# EAGLE design BUZZI-41 (EAGLE 4.15)
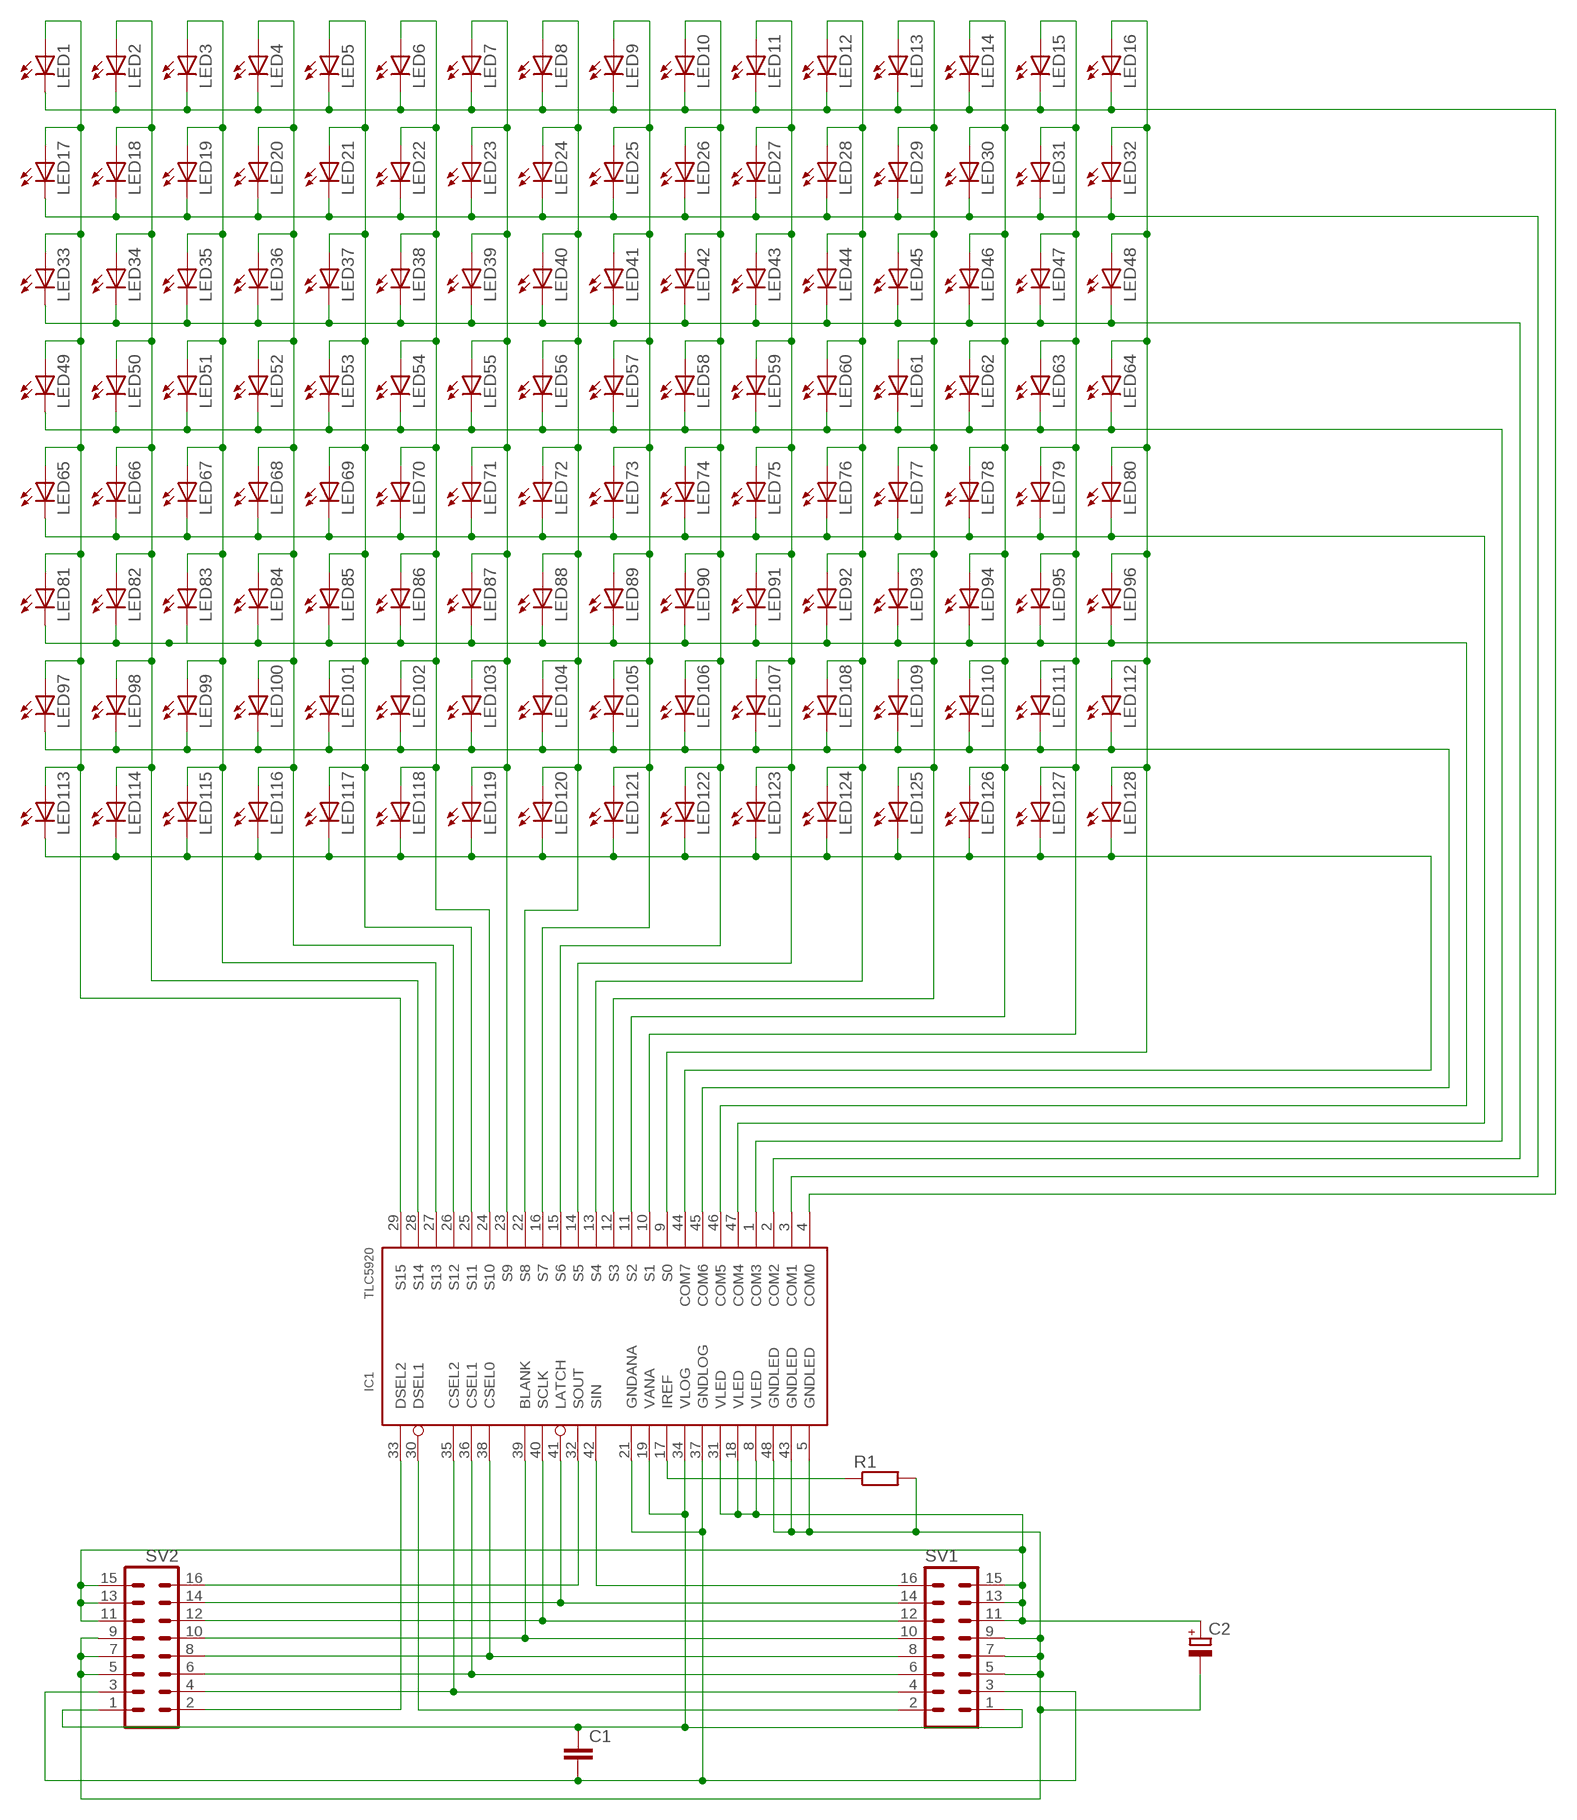
[diagram p0: schematic, sheet 1]

## Parts
C1  C-EUC0805K  [C0805K]
C2  CPOL-EUE3.5-8  [E3,5-8]
IC1  TLC5920  [SSOP48DL]
LED1  LED5MM  [LED5MM]
LED2  LED5MM  [LED5MM]
LED3  LED5MM  [LED5MM]
LED4  LED5MM  [LED5MM]
LED5  LED5MM  [LED5MM]
LED6  LED5MM  [LED5MM]
LED7  LED5MM  [LED5MM]
LED8  LED5MM  [LED5MM]
LED9  LED5MM  [LED5MM]
LED10  LED5MM  [LED5MM]
LED11  LED5MM  [LED5MM]
LED12  LED5MM  [LED5MM]
LED13  LED5MM  [LED5MM]
LED14  LED5MM  [LED5MM]
LED15  LED5MM  [LED5MM]
LED16  LED5MM  [LED5MM]
LED17  LED5MM  [LED5MM]
LED18  LED5MM  [LED5MM]
LED19  LED5MM  [LED5MM]
LED20  LED5MM  [LED5MM]
LED21  LED5MM  [LED5MM]
LED22  LED5MM  [LED5MM]
LED23  LED5MM  [LED5MM]
LED24  LED5MM  [LED5MM]
LED25  LED5MM  [LED5MM]
LED26  LED5MM  [LED5MM]
LED27  LED5MM  [LED5MM]
LED28  LED5MM  [LED5MM]
LED29  LED5MM  [LED5MM]
LED30  LED5MM  [LED5MM]
LED31  LED5MM  [LED5MM]
LED32  LED5MM  [LED5MM]
LED33  LED5MM  [LED5MM]
LED34  LED5MM  [LED5MM]
LED35  LED5MM  [LED5MM]
LED36  LED5MM  [LED5MM]
LED37  LED5MM  [LED5MM]
LED38  LED5MM  [LED5MM]
LED39  LED5MM  [LED5MM]
LED40  LED5MM  [LED5MM]
LED41  LED5MM  [LED5MM]
LED42  LED5MM  [LED5MM]
LED43  LED5MM  [LED5MM]
LED44  LED5MM  [LED5MM]
LED45  LED5MM  [LED5MM]
LED46  LED5MM  [LED5MM]
LED47  LED5MM  [LED5MM]
LED48  LED5MM  [LED5MM]
LED49  LED5MM  [LED5MM]
LED50  LED5MM  [LED5MM]
LED51  LED5MM  [LED5MM]
LED52  LED5MM  [LED5MM]
LED53  LED5MM  [LED5MM]
LED54  LED5MM  [LED5MM]
LED55  LED5MM  [LED5MM]
LED56  LED5MM  [LED5MM]
LED57  LED5MM  [LED5MM]
LED58  LED5MM  [LED5MM]
LED59  LED5MM  [LED5MM]
LED60  LED5MM  [LED5MM]
LED61  LED5MM  [LED5MM]
LED62  LED5MM  [LED5MM]
LED63  LED5MM  [LED5MM]
LED64  LED5MM  [LED5MM]
LED65  LED5MM  [LED5MM]
LED66  LED5MM  [LED5MM]
LED67  LED5MM  [LED5MM]
LED68  LED5MM  [LED5MM]
LED69  LED5MM  [LED5MM]
LED70  LED5MM  [LED5MM]
LED71  LED5MM  [LED5MM]
LED72  LED5MM  [LED5MM]
LED73  LED5MM  [LED5MM]
LED74  LED5MM  [LED5MM]
LED75  LED5MM  [LED5MM]
LED76  LED5MM  [LED5MM]
LED77  LED5MM  [LED5MM]
LED78  LED5MM  [LED5MM]
LED79  LED5MM  [LED5MM]
LED80  LED5MM  [LED5MM]
LED81  LED5MM  [LED5MM]
LED82  LED5MM  [LED5MM]
LED83  LED5MM  [LED5MM]
LED84  LED5MM  [LED5MM]
LED85  LED5MM  [LED5MM]
LED86  LED5MM  [LED5MM]
LED87  LED5MM  [LED5MM]
LED88  LED5MM  [LED5MM]
LED89  LED5MM  [LED5MM]
LED90  LED5MM  [LED5MM]
LED91  LED5MM  [LED5MM]
LED92  LED5MM  [LED5MM]
LED93  LED5MM  [LED5MM]
LED94  LED5MM  [LED5MM]
LED95  LED5MM  [LED5MM]
LED96  LED5MM  [LED5MM]
LED97  LED5MM  [LED5MM]
LED98  LED5MM  [LED5MM]
LED99  LED5MM  [LED5MM]
LED100  LED5MM  [LED5MM]
LED101  LED5MM  [LED5MM]
LED102  LED5MM  [LED5MM]
LED103  LED5MM  [LED5MM]
LED104  LED5MM  [LED5MM]
LED105  LED5MM  [LED5MM]
LED106  LED5MM  [LED5MM]
LED107  LED5MM  [LED5MM]
LED108  LED5MM  [LED5MM]
LED109  LED5MM  [LED5MM]
LED110  LED5MM  [LED5MM]
LED111  LED5MM  [LED5MM]
LED112  LED5MM  [LED5MM]
LED113  LED5MM  [LED5MM]
LED114  LED5MM  [LED5MM]
LED115  LED5MM  [LED5MM]
LED116  LED5MM  [LED5MM]
LED117  LED5MM  [LED5MM]
LED118  LED5MM  [LED5MM]
LED119  LED5MM  [LED5MM]
LED120  LED5MM  [LED5MM]
LED121  LED5MM  [LED5MM]
LED122  LED5MM  [LED5MM]
LED123  LED5MM  [LED5MM]
LED124  LED5MM  [LED5MM]
LED125  LED5MM  [LED5MM]
LED126  LED5MM  [LED5MM]
LED127  LED5MM  [LED5MM]
LED128  LED5MM  [LED5MM]
R1  R-EU_R0805  [R0805]
SV1  MA08-2  [MA08-2]
SV2  MA08-2  [MA08-2]

## Nets
N$1: IC1.4(COM0) LED1.K(C) LED2.K(C) LED3.K(C) LED4.K(C) LED5.K(C) LED6.K(C) LED7.K(C) LED8.K(C) LED9.K(C) LED10.K(C) LED11.K(C) LED12.K(C) LED13.K(C) LED14.K(C) LED15.K(C) LED16.K(C)
N$2: IC1.29(S15) LED1.A LED17.A LED33.A LED49.A LED65.A LED81.A LED97.A LED113.A
N$3: IC1.28(S14) LED2.A LED18.A LED34.A LED50.A LED66.A LED82.A LED98.A LED114.A
N$4: IC1.27(S13) LED3.A LED19.A LED35.A LED51.A LED67.A LED83.A LED99.A LED115.A
N$5: IC1.26(S12) LED4.A LED20.A LED36.A LED52.A LED68.A LED84.A LED100.A LED116.A
N$6: IC1.25(S11) LED5.A LED21.A LED37.A LED53.A LED69.A LED85.A LED101.A LED117.A
N$7: IC1.24(S10) LED6.A LED22.A LED38.A LED54.A LED70.A LED86.A LED102.A LED118.A
N$8: IC1.23(S9) LED7.A LED23.A LED39.A LED55.A LED71.A LED87.A LED103.A LED119.A
N$9: IC1.22(S8) LED8.A LED24.A LED40.A LED56.A LED72.A LED88.A LED104.A LED120.A
N$10: IC1.16(S7) LED9.A LED25.A LED41.A LED57.A LED73.A LED89.A LED105.A LED121.A
N$11: IC1.15(S6) LED10.A LED26.A LED42.A LED58.A LED74.A LED90.A LED106.A LED122.A
N$12: IC1.14(S5) LED11.A LED27.A LED43.A LED59.A LED75.A LED91.A LED107.A LED123.A
N$13: IC1.13(S4) LED12.A LED28.A LED44.A LED60.A LED76.A LED92.A LED108.A LED124.A
N$14: IC1.12(S3) LED13.A LED29.A LED45.A LED61.A LED77.A LED93.A LED109.A LED125.A
N$15: IC1.11(S2) LED14.A LED30.A LED46.A LED62.A LED78.A LED94.A LED110.A LED126.A
N$16: IC1.10(S1) LED15.A LED31.A LED47.A LED63.A LED79.A LED95.A LED111.A LED127.A
N$17: IC1.9(S0) LED16.A LED32.A LED48.A LED64.A LED80.A LED96.A LED112.A LED128.A
N$18: IC1.3(COM1) LED17.K(C) LED18.K(C) LED19.K(C) LED20.K(C) LED21.K(C) LED22.K(C) LED23.K(C) LED24.K(C) LED25.K(C) LED26.K(C) LED27.K(C) LED28.K(C) LED29.K(C) LED30.K(C) LED31.K(C) LED32.K(C)
N$19: IC1.2(COM2) LED33.K(C) LED34.K(C) LED35.K(C) LED36.K(C) LED37.K(C) LED38.K(C) LED39.K(C) LED40.K(C) LED41.K(C) LED42.K(C) LED43.K(C) LED44.K(C) LED45.K(C) LED46.K(C) LED47.K(C) LED48.K(C)
N$20: IC1.1(COM3) LED49.K(C) LED50.K(C) LED51.K(C) LED52.K(C) LED53.K(C) LED54.K(C) LED55.K(C) LED56.K(C) LED57.K(C) LED58.K(C) LED59.K(C) LED60.K(C) LED61.K(C) LED62.K(C) LED63.K(C) LED64.K(C)
N$21: IC1.47(COM4) LED65.K(C) LED66.K(C) LED67.K(C) LED68.K(C) LED69.K(C) LED70.K(C) LED71.K(C) LED72.K(C) LED73.K(C) LED74.K(C) LED75.K(C) LED76.K(C) LED77.K(C) LED78.K(C) LED79.K(C) LED80.K(C)
N$22: IC1.46(COM5) LED81.K(C) LED82.K(C) LED83.K(C) LED84.K(C) LED85.K(C) LED86.K(C) LED87.K(C) LED88.K(C) LED89.K(C) LED90.K(C) LED91.K(C) LED92.K(C) LED93.K(C) LED94.K(C) LED95.K(C) LED96.K(C)
N$23: IC1.45(COM6) LED97.K(C) LED98.K(C) LED99.K(C) LED100.K(C) LED101.K(C) LED102.K(C) LED103.K(C) LED104.K(C) LED105.K(C) LED106.K(C) LED107.K(C) LED108.K(C) LED109.K(C) LED110.K(C) LED111.K(C) LED112.K(C)
N$24: IC1.44(COM7) LED113.K(C) LED114.K(C) LED115.K(C) LED116.K(C) LED117.K(C) LED118.K(C) LED119.K(C) LED120.K(C) LED121.K(C) LED122.K(C) LED123.K(C) LED124.K(C) LED125.K(C) LED126.K(C) LED127.K(C) LED128.K(C)
N$25: IC1.42(SIN) SV1.16
N$26: IC1.41(LATCH) SV1.14 SV2.14
N$27: IC1.40(SCLK) SV1.12 SV2.12
N$28: IC1.39(BLANK) SV1.10 SV2.10
N$29: IC1.38(CSEL0) SV1.8 SV2.8
N$30: IC1.36(CSEL1) SV1.6 SV2.6
N$31: IC1.35(CSEL2) SV1.4 SV2.4
N$32: C1.1 IC1.19(VANA) IC1.34(VLOG) SV1.1 SV2.1
N$34: IC1.30(DSEL1) SV1.2
N$35: IC1.32(SOUT) SV2.16
N$36: IC1.33(DSEL2) SV2.2
N$37 [supply]: C2.+ IC1.8(VLED) IC1.18(VLED) IC1.31(VLED) SV1.11 SV1.13 SV1.15 SV2.11 SV2.13 SV2.15
N$38 [supply]: C2.- IC1.5(GNDLED) IC1.43(GNDLED) IC1.48(GNDLED) R1.2 SV1.5 SV1.7 SV1.9 SV2.5 SV2.7 SV2.9
N$39: C1.2 IC1.21(GNDANA) IC1.37(GNDLOG) SV1.3 SV2.3
N$40: IC1.17(IREF) R1.1

## Library data of the parts
C1 = rcl:C-EU: CAPACITOR, European symbol
C2 = rcl:CPOL-EU: POLARIZED CAPACITOR, European symbol
IC1 = turbod3:TLC5920
LED1-LED128 = SparkFunEagle-6-6-07:LED: LEDs Standard schematic elements and footprints for 5mm, 3mm, 1206, and 0603 sized LEDs. 5mm - Spark Fun Electronics SKU : COM-00529 (and others)
R1 = rcl:R-EU_: RESISTOR, European symbol
SV1 SV2 = con-lstb:MA08-2: PIN HEADER

## Net classes
0 default: width 0.2 mm
1 supply: width 0.5 mm
2 supplythrough: width 1 mm

## Board
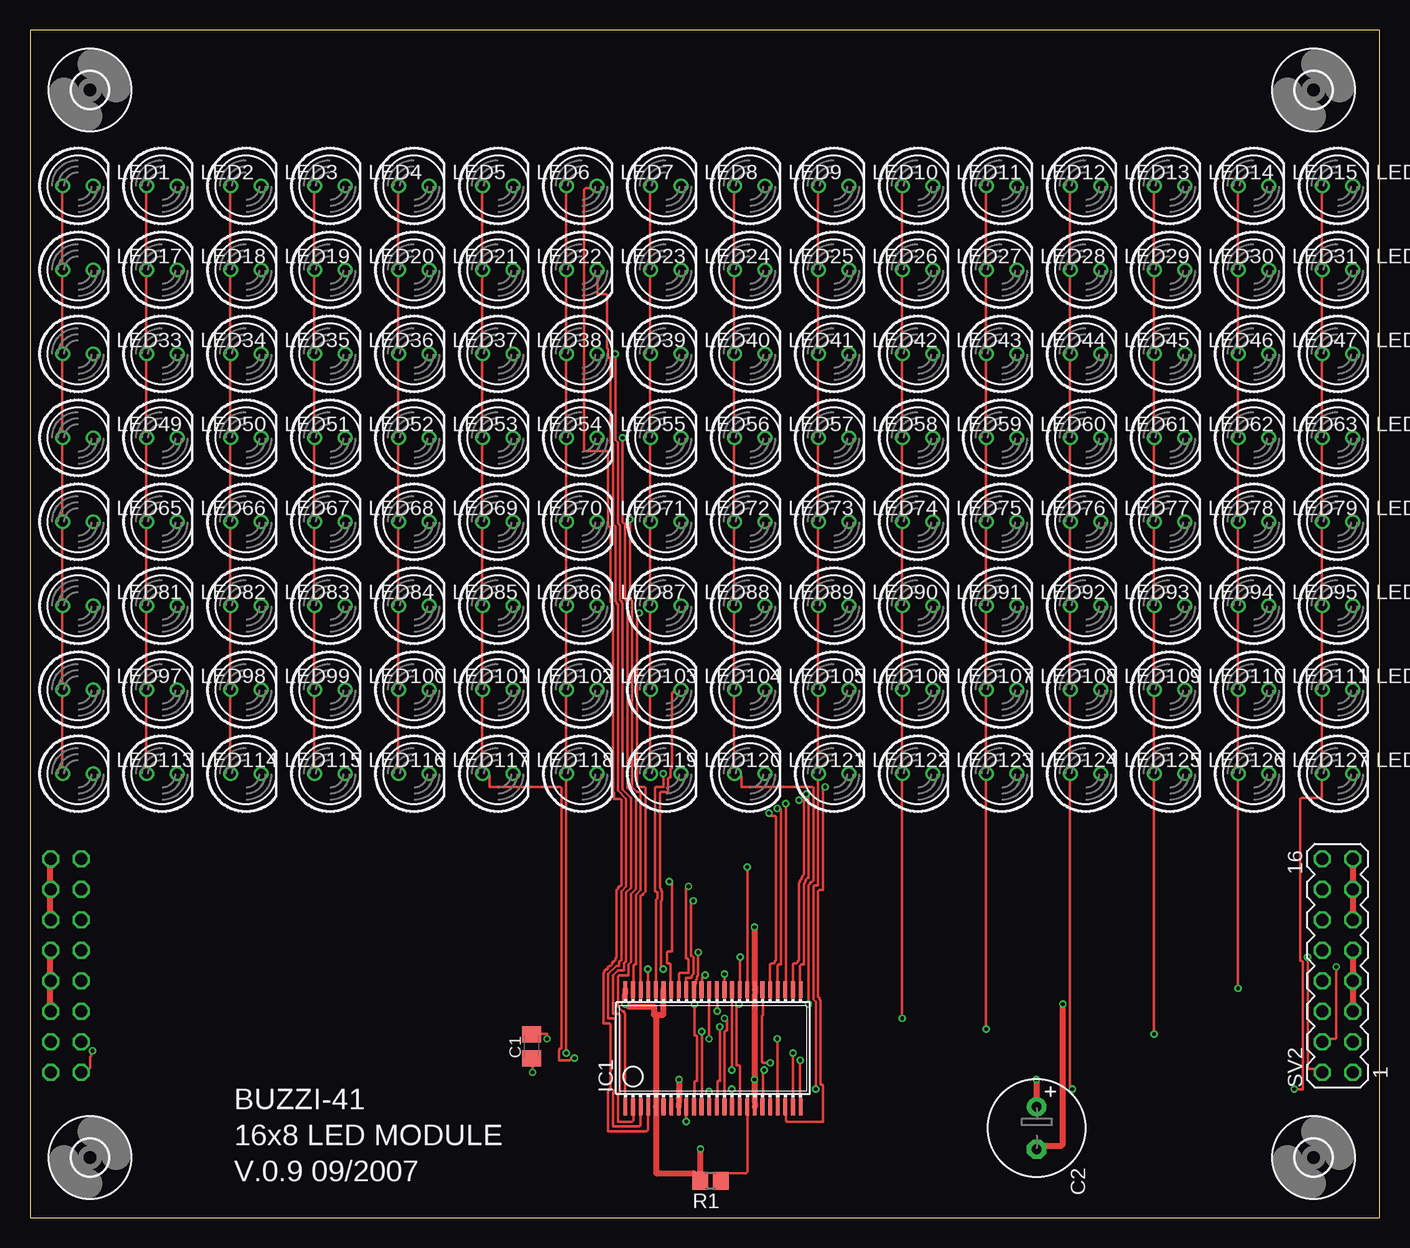
[diagram p1: board, top side]
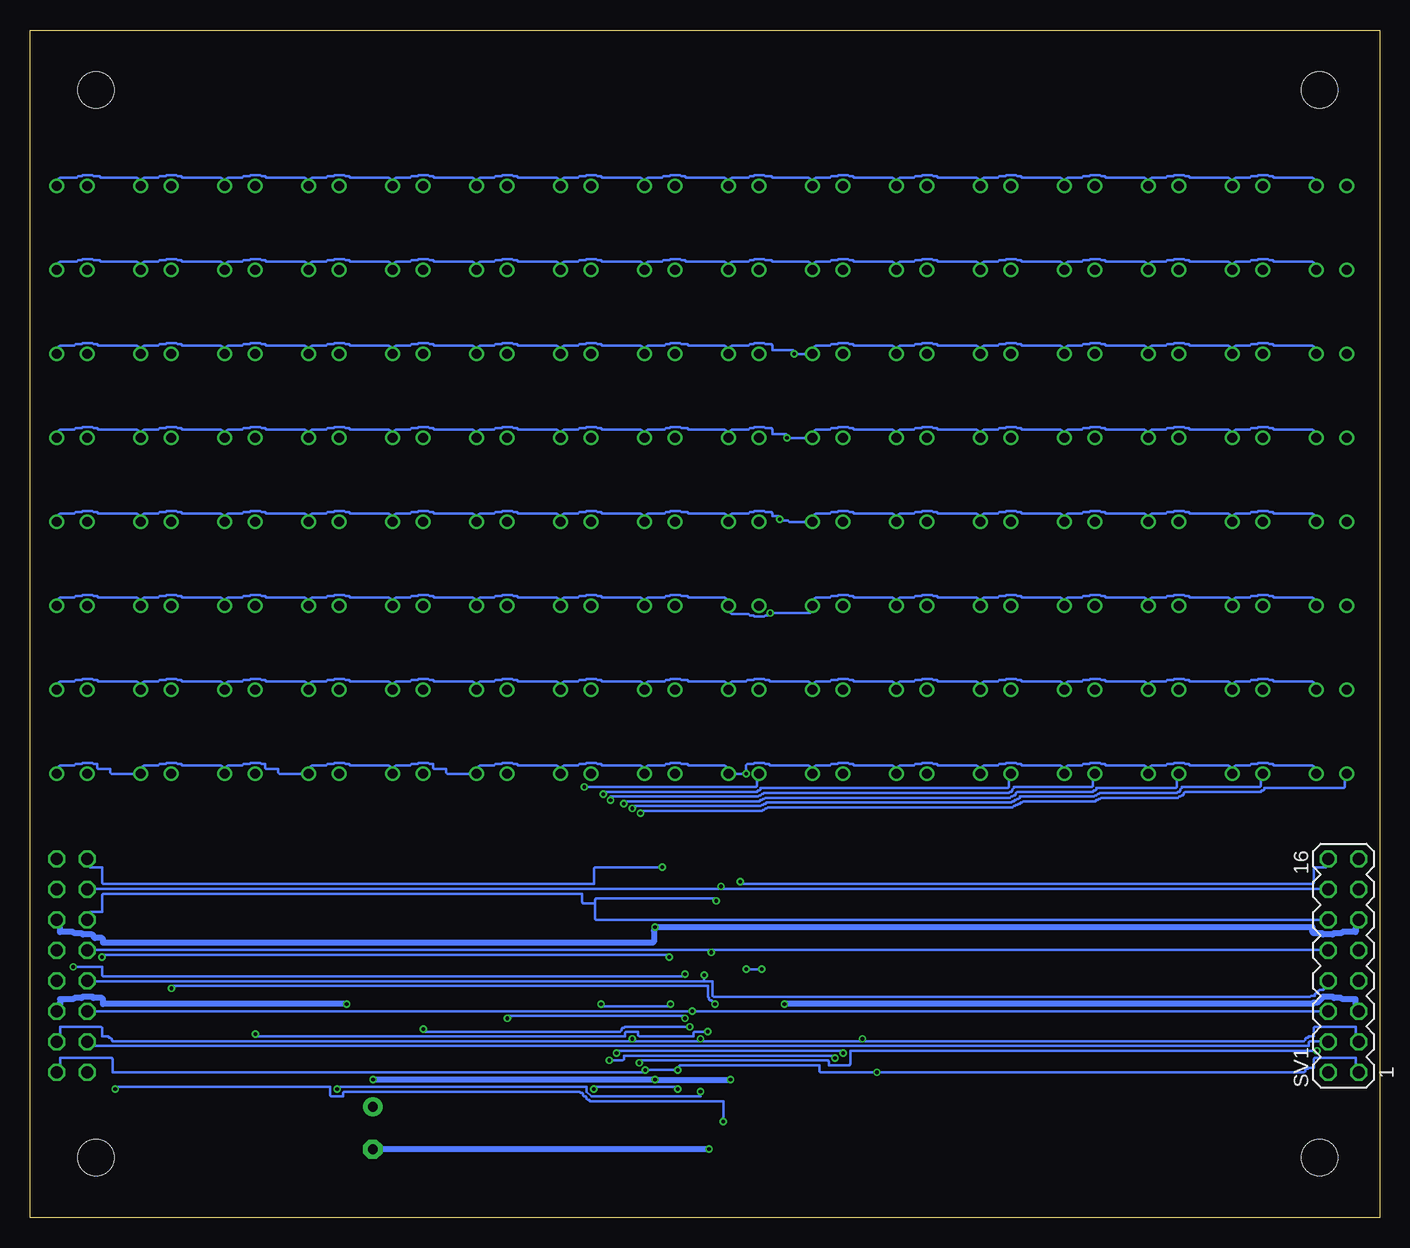
[diagram p2: board, bottom side, seen from below]

Size 112.5 x 99 mm. Coordinates in mm from the lower left corner, seen from the top.
Outline: 0,0 112.5,0 112.5,99 0,99 0,0
Copper layers (1*16): Top 0.035mm / dielectric 1.5mm / Bottom 0.035mm
Design rules "PCB-POOL": minimum track width 6mil, minimum drill 12mil, track to track 6mil, track to pad 6mil, pad to pad 6mil, via to via 6mil, smd to smd 6mil, copper to edge 20mil, drill to drill 8mil, minimum pad ring 8mil, minimum via ring 6mil, stop-mask expansion 3mil, vias tented up to drill 0mil, thermal gap 8mil

### Footprints (pad centres in the part's own frame; a part is rotated, then mirrored left to right if it is on the bottom)
C0805K = smd 1.3 x 1.6: 1 -1,0; 2 1,0
E3,5-8 = drill 0.813 pad 1.6 round: + -1.778,0 | drill 0.813 pad 1.6 octagon: - 1.778,0
SSOP48DL = smd 0.305 x 1.422: 1 -6.985,-4.877; 2 -6.35,-4.877; 3 -5.715,-4.877; 4 -5.08,-4.877; 5 -4.445,-4.877; 6 -3.81,-4.877; 7 -3.175,-4.877; 8 -2.54,-4.877; 9 -1.905,-4.877; 10 -1.27,-4.877; 11 -0.635,-4.877; 12 0,-4.877; 13 0.635,-4.877; 14 1.27,-4.877; 15 1.905,-4.877; 16 2.54,-4.877; 17 3.175,-4.877; 18 3.81,-4.877; 19 4.445,-4.877; 20 5.08,-4.877; 21 5.715,-4.877; 22 6.35,-4.877; 23 6.985,-4.877; 24 7.62,-4.877; 25 7.62,4.877; 26 6.985,4.877; 27 6.35,4.877; 28 5.715,4.877; 29 5.08,4.877; 30 4.445,4.877; 31 3.81,4.877; 32 3.175,4.877; 33 2.54,4.877; 34 1.905,4.877; 35 1.27,4.877; 36 0.635,4.877; 37 0,4.877; 38 -0.635,4.877; 39 -1.27,4.877; 40 -1.905,4.877; 41 -2.54,4.877; 42 -3.175,4.877; 43 -3.81,4.877; 44 -4.445,4.877; 45 -5.08,4.877; 46 -5.715,4.877; 47 -6.35,4.877; 48 -6.985,4.877
LED5MM = drill 0.813 round: A -1.27,0; K 1.27,0
R0805 = smd 1.3 x 1.5: 1 -0.85,0; 2 0.85,0
MA08-2 = drill 1.016 octagon: 1 -8.89,-1.27; 2 -8.89,1.27; 3 -6.35,-1.27; 4 -6.35,1.27; 5 -3.81,-1.27; 6 -3.81,1.27; 7 -1.27,-1.27; 8 -1.27,1.27; 9 1.27,-1.27; 10 1.27,1.27; 11 3.81,-1.27; 12 3.81,1.27; 13 6.35,-1.27; 14 6.35,1.27; 15 8.89,-1.27; 16 8.89,1.27
3,0 = hole 3: 0,0

### Placement (x,y rotation side)
C1  41.81,14.27 90 top
C2  83.92,7.46 270 top
IC1  56.62,14.11 0 top
LED1  4,86 0 top
LED2  11,86 0 top
LED3  18,86 0 top
LED4  25,86 0 top
LED5  32,86 0 top
LED6  39,86 0 top
LED7  46,86 0 top
LED8  53,86 0 top
LED9  60,86 0 top
LED10  67,86 0 top
LED11  74,86 0 top
LED12  81,86 0 top
LED13  88,86 0 top
LED14  95,86 0 top
LED15  102,86 0 top
LED16  109,86 0 top
LED17  4,79 0 top
LED18  11,79 0 top
LED19  18,79 0 top
LED20  25,79 0 top
LED21  32,79 0 top
LED22  39,79 0 top
LED23  46,79 0 top
LED24  53,79 0 top
LED25  60,79 0 top
LED26  67,79 0 top
LED27  74,79 0 top
LED28  81,79 0 top
LED29  88,79 0 top
LED30  95,79 0 top
LED31  102,79 0 top
LED32  109,79 0 top
LED33  4,72 0 top
LED34  11,72 0 top
LED35  18,72 0 top
LED36  25,72 0 top
LED37  32,72 0 top
LED38  39,72 0 top
LED39  46,72 0 top
LED40  53,72 0 top
LED41  60,72 0 top
LED42  67,72 0 top
LED43  74,72 0 top
LED44  81,72 0 top
LED45  88,72 0 top
LED46  95,72 0 top
LED47  102,72 0 top
LED48  109,72 0 top
LED49  4,65 0 top
LED50  11,65 0 top
LED51  18,65 0 top
LED52  25,65 0 top
LED53  32,65 0 top
LED54  39,65 0 top
LED55  46,65 0 top
LED56  53,65 0 top
LED57  60,65 0 top
LED58  67,65 0 top
LED59  74,65 0 top
LED60  81,65 0 top
LED61  88,65 0 top
LED62  95,65 0 top
LED63  102,65 0 top
LED64  109,65 0 top
LED65  4,58 0 top
LED66  11,58 0 top
LED67  18,58 0 top
LED68  25,58 0 top
LED69  32,58 0 top
LED70  39,58 0 top
LED71  46,58 0 top
LED72  53,58 0 top
LED73  60,58 0 top
LED74  67,58 0 top
LED75  74,58 0 top
LED76  81,58 0 top
LED77  88,58 0 top
LED78  95,58 0 top
LED79  102,58 0 top
LED80  109,58 0 top
LED81  4,51 0 top
LED82  11,51 0 top
LED83  18,51 0 top
LED84  25,51 0 top
LED85  32,51 0 top
LED86  39,51 0 top
LED87  46,51 0 top
LED88  53,51 0 top
LED89  60,51 0 top
LED90  67,51 0 top
LED91  74,51 0 top
LED92  81,51 0 top
LED93  88,51 0 top
LED94  95,51 0 top
LED95  102,51 0 top
LED96  109,51 0 top
LED97  4,44 0 top
LED98  11,44 0 top
LED99  18,44 0 top
LED100  25,44 0 top
LED101  32,44 0 top
LED102  39,44 0 top
LED103  46,44 0 top
LED104  53,44 0 top
LED105  60,44 0 top
LED106  67,44 0 top
LED107  74,44 0 top
LED108  81,44 0 top
LED109  88,44 0 top
LED110  95,44 0 top
LED111  102,44 0 top
LED112  109,44 0 top
LED113  4,37 0 top
LED114  11,37 0 top
LED115  18,37 0 top
LED116  25,37 0 top
LED117  32,37 0 top
LED118  39,37 0 top
LED119  46,37 0 top
LED120  53,37 0 top
LED121  60,37 0 top
LED122  67,37 0 top
LED123  74,37 0 top
LED124  81,37 0 top
LED125  88,37 0 top
LED126  95,37 0 top
LED127  102,37 0 top
LED128  109,37 0 top
R1  56.73,3.05 180 top
SV1  3,21 90 bottom
SV2  109,21 90 top
U$2  [3,0]  5,94 0 top
U$3  [3,0]  107,94 0 top
U$4  [3,0]  107,5 0 top
U$5  [3,0]  5,5 0 top

### Tracks (layer width: path | path; a pad name or v marks a point on that pad's centre or on a via)
N$1
  Top 0.2: IC1.4 51.5,8.6 51.5,7.3 51.4,7.2 48.2,7.2 48.2,10.5 48.3,10.6 48.3,10.7 48.4,10.8 48.4,16.1 48.3,16.2 47.8,16.2 47.8,20.4 47.9,20.5 47.9,20.6 48,20.7 48.1,20.7 48.2,20.8 48.2,20.9 48.3,21 48.4,21 48.5,21.1 48.5,21.2 48.6,21.3 48.7,21.3 48.7,21.4 48.8,21.5 48.8,21.6 48.9,21.7 48.9,27.3 49,27.4 49,27.5 49.1,27.6 49.2,27.6 49.3,27.7 49.3,34.8 49.2,34.9 48.7,34.9 48.7,35.4 48.6,35.5 48.6,51 48.5,51.1 48.5,51.2 48.4,51.3 48.4,57.5 48.3,57.6 48.2,57.6 48.2,63.8 48.1,63.9 46.2,63.9 46.2,85.7 46.3,85.8 46.7,85.8 LED7.K
  Bottom 0.2: LED16.K 110.1,86.6 110,86.7 108.6,86.7 108.5,86.8 108.2,86.8 108.1,86.9 107.3,86.9 107.2,86.8 106.7,86.8 106.6,86.7 103.6,86.7 103.5,86.6 LED15.K 103.1,86.6 103,86.7 101.8,86.7 101.7,86.8 101.2,86.8 101.1,86.9 100.3,86.9 100.2,86.8 99.9,86.8 99.8,86.7 96.6,86.7 96.5,86.6 LED14.K 96.1,86.6 96,86.7 94.8,86.7 94.7,86.8 94.2,86.8 94.1,86.9 93.3,86.9 93.2,86.8 92.9,86.8 92.8,86.7 89.6,86.7 89.5,86.6 LED13.K 89.1,86.6 89,86.7 87.8,86.7 87.7,86.8 87.2,86.8 87.1,86.9 86.3,86.9 86.2,86.8 85.9,86.8 85.8,86.7 82.6,86.7 82.5,86.6 LED12.K 82.1,86.6 82,86.7 80.8,86.7 80.7,86.8 80.2,86.8 80.1,86.9 79.3,86.9 79.2,86.8 78.9,86.8 78.8,86.7 75.6,86.7 75.5,86.6 LED11.K 75.1,86.6 75,86.7 73.8,86.7 73.7,86.8 73.2,86.8 73.1,86.9 72.3,86.9 72.2,86.8 71.9,86.8 71.8,86.7 68.6,86.7 68.5,86.6 LED10.K 68.1,86.6 68,86.7 66.8,86.7 66.7,86.8 66.2,86.8 66.1,86.9 65.3,86.9 65.2,86.8 64.9,86.8 64.8,86.7 61.6,86.7 61.5,86.6 LED9.K 61.1,86.6 61,86.7 59.8,86.7 59.7,86.8 59.2,86.8 59.1,86.9 58.3,86.9 58.2,86.8 57.9,86.8 57.8,86.7 54.6,86.7 54.5,86.6 LED8.K 54.1,86.6 54,86.7 52.6,86.7 52.5,86.8 52.2,86.8 52.1,86.9 51.3,86.9 51.2,86.8 50.7,86.8 50.6,86.7 47.6,86.7 47.5,86.6 LED7.K 47.1,86.6 47,86.7 45.8,86.7 45.7,86.8 45.2,86.8 45.1,86.9 44.3,86.9 44.2,86.8 43.9,86.8 43.8,86.7 40.6,86.7 40.5,86.6 LED6.K 40.1,86.6 40,86.7 38.8,86.7 38.7,86.8 38.2,86.8 38.1,86.9 37.3,86.9 37.2,86.8 36.9,86.8 36.8,86.7 33.6,86.7 33.5,86.6 LED5.K 33.1,86.6 33,86.7 31.8,86.7 31.7,86.8 31.2,86.8 31.1,86.9 30.3,86.9 30.2,86.8 29.9,86.8 29.8,86.7 26.6,86.7 26.5,86.6 LED4.K 26.1,86.6 26,86.7 24.8,86.7 24.7,86.8 24.2,86.8 24.1,86.9 23.3,86.9 23.2,86.8 22.9,86.8 22.8,86.7 19.6,86.7 19.5,86.6 LED3.K 19.1,86.6 19,86.7 17.8,86.7 17.7,86.8 17.2,86.8 17.1,86.9 16.3,86.9 16.2,86.8 15.9,86.8 15.8,86.7 12.6,86.7 12.5,86.6 LED2.K 12.1,86.6 12,86.7 10.8,86.7 10.7,86.8 10.2,86.8 10.1,86.9 9.3,86.9 9.2,86.8 8.9,86.8 8.8,86.7 5.6,86.7 5.5,86.6 LED1.K
N$2  (via drill 0.3)
  Top 0.2: LED1.A 2.7,85.4 2.7,79.6 LED17.A 2.7,78.4 2.7,72.6 LED33.A 2.7,71.4 2.7,65.6 LED49.A 2.7,64.4 2.7,58.6 LED65.A 2.7,57.4 2.7,51.6 LED81.A 2.7,50.4 2.7,44.6 LED97.A 2.7,43.4 2.7,37.6 LED113.A | v61.6,33.7 61.6,33.5 62.1,33.5 62.2,33.4 62.2,21.5 62.1,21.4 62.1,21.3 62,21.2 61.8,21.2 61.7,21.1 IC1.29
  Bottom 0.2: v61.6,33.7 61.6,33.9 51.5,33.9 51.4,34 51.3,34 51.2,34.1 51.1,34.1 51,34.2 30.6,34.2 30.5,34.3 30.4,34.3 30.3,34.4 30.2,34.4 30.1,34.5 30,34.5 29.9,34.6 29.8,34.6 29.7,34.7 23.7,34.7 23.6,34.8 23.5,34.8 23.4,34.9 23.3,34.9 23.2,35 16.8,35 16.7,35.1 16.6,35.1 16.5,35.2 16.4,35.2 16.3,35.3 16.3,35.4 16.2,35.5 9.9,35.5 9.8,35.6 9.7,35.6 9.6,35.7 9.6,35.8 3,35.8 2.9,35.9 2.9,36.4 LED113.A
N$3  (via drill 0.3)
  Top 0.2: LED2.A 9.7,85.4 9.7,79.6 LED18.A 9.7,78.4 9.7,72.6 LED34.A 9.7,71.4 9.7,65.6 LED50.A 9.7,64.4 9.7,58.6 LED66.A 9.7,57.4 9.7,51.6 LED82.A 9.7,50.4 9.7,44.6 LED98.A 9.7,43.4 9.7,37.6 LED114.A | v62.3,34.1 62.5,34.1 62.6,34 62.6,21.1 62.4,21.1 62.3,21 62.3,19.6 IC1.28
  Bottom 0.2: v62.3,34.1 62.3,34.3 51.6,34.3 51.5,34.4 51.4,34.4 51.3,34.5 51.2,34.5 51.1,34.6 30.7,34.6 30.6,34.7 30.5,34.7 30.4,34.8 30.3,34.8 30.2,34.9 30.1,34.9 30,35 30,35.1 23.8,35.1 23.7,35.2 23.6,35.2 23.5,35.3 23.4,35.3 23.3,35.4 16.9,35.4 16.8,35.5 16.7,35.5 16.6,35.6 16.6,35.7 16.5,35.8 16.5,35.9 10,35.9 9.9,36 9.9,36.4 LED114.A
N$4  (via drill 0.3)
  Top 0.2: LED3.A 16.7,85.4 16.7,79.6 LED19.A 16.7,78.4 16.7,72.6 LED35.A 16.7,71.4 16.7,65.6 LED51.A 16.7,64.4 16.7,58.6 LED67.A 16.7,57.4 16.7,51.6 LED83.A 16.7,50.4 16.7,44.6 LED99.A 16.7,43.4 16.7,37.6 LED115.A | v63,34.5 63,19.6 IC1.27
  Bottom 0.2: v63,34.5 63,34.7 51.7,34.7 51.6,34.8 51.5,34.8 51.4,34.9 51.3,34.9 51.2,35 30.8,35 30.7,35.1 30.6,35.1 30.5,35.2 30.4,35.2 30.3,35.3 30.3,35.4 30.2,35.5 23.9,35.5 23.8,35.6 23.7,35.6 23.6,35.7 23.6,35.8 17,35.8 16.9,35.9 16.9,36.4 LED115.A
N$5  (via drill 0.3)
  Top 0.2: LED4.A 23.7,85.4 23.7,79.6 LED20.A 23.7,78.4 23.7,72.6 LED36.A 23.7,71.4 23.7,65.6 LED52.A 23.7,64.4 23.7,58.6 LED68.A 23.7,57.4 23.7,51.6 LED84.A 23.7,50.4 23.7,44.6 LED100.A 23.7,43.4 23.7,37.6 LED116.A | v64.1,34.8 64.4,34.8 64.5,34.7 64.5,28.6 64.4,28.5 64.4,28.4 64.3,28.3 64.3,28.2 64.2,28.1 64.2,28 64.1,27.9 64.1,21.5 64,21.4 64,21.3 63.9,21.2 63.7,21.2 63.6,21.1 63.6,19.6 IC1.26
  Bottom 0.2: v64.1,34.8 64.1,35.1 51.8,35.1 51.7,35.2 51.6,35.2 51.5,35.3 51.4,35.3 51.3,35.4 30.9,35.4 30.8,35.5 30.7,35.5 30.6,35.6 30.6,35.7 30.5,35.8 30.5,35.9 24,35.9 23.9,36 23.9,36.4 LED116.A
N$6  (via drill 0.3)
  Top 0.2: LED5.A 30.7,85.4 30.7,79.6 LED21.A 30.7,78.4 30.7,72.6 LED37.A 30.7,71.4 30.7,65.6 LED53.A 30.7,64.4 30.7,58.6 LED69.A 30.7,57.4 30.7,51.6 LED85.A 30.7,50.4 30.7,44.6 LED101.A 30.7,43.4 30.7,37.6 LED117.A | v64.7,35.3 64.8,35.3 64.9,35.2 64.9,28.3 64.8,28.3 64.7,28.2 64.7,28.1 64.6,28 64.6,27.9 64.5,27.8 64.5,21.1 64.3,21.1 64.2,21 64.2,19.6 IC1.25
  Bottom 0.2: v64.7,35.3 64.7,35.5 51.9,35.5 51.8,35.6 51.7,35.6 51.6,35.7 51.6,35.8 31,35.8 30.9,35.9 30.9,36.4 LED117.A
N$7  (via drill 0.3)
  Top 0.2: LED6.A 37.7,85.4 37.7,79.6 LED22.A 37.7,78.4 37.7,72.6 LED38.A 37.7,71.4 37.7,65.6 LED54.A 37.7,64.4 37.7,58.6 LED70.A 37.7,57.4 37.7,51.6 LED86.A 37.7,50.4 37.7,44.6 LED102.A 37.7,43.4 37.7,37.6 LED118.A 38.3,36.8 38.3,35.9 44.2,35.9 44.3,35.8 44.3,14.1 44.2,14.1 44.1,14 44.1,13.1 45,13.1 45.1,13.2 45.1,13.3 v45.4,13.3 | v64.2,13.1 64.2,9.9 IC1.24
  Bottom 0.2: v64.2,13.1 63.1,13.1 63,13.2 63,13.5 45.5,13.5 45.4,13.4 v45.4,13.3
N$8  (via drill 0.3)
  Top 0.2: LED7.A 44.7,85.4 44.7,79.6 LED23.A 44.7,78.4 44.7,72.6 LED39.A 44.7,71.4 44.7,65.6 LED55.A 44.7,64.4 44.7,58.6 LED71.A 44.7,57.4 44.7,51.6 LED87.A 44.7,50.4 44.7,44.6 LED103.A 44.7,43.4 44.7,37.6 LED119.A 44.7,36.4 v44.7,13.7 | v63.6,13.7 63.6,9.9 IC1.23
  Bottom 0.2: v63.6,13.7 63.6,13.9 44.8,13.9 44.7,13.8 v44.7,13.7
N$9  (via drill 0.3)
  Top 0.2: LED8.A 51.7,85.4 51.7,79.6 LED24.A 51.7,78.4 51.7,72.6 LED40.A 51.7,71.4 51.7,65.6 LED56.A 51.7,64.4 51.7,58.6 LED72.A 51.7,57.4 51.7,51.6 LED88.A 51.7,50.4 51.7,44.6 LED104.A 51.7,43.4 51.7,37.6 LED120.A | v66.3,35.9 66.2,35.9 66.1,35.8 66.1,27.3 65.8,27.3 65.7,27.2 65.7,18.4 65.8,18.3 65.8,18.2 65.9,18.1 65.9,11.1 66,11.1 66.1,11 66.1,8 63.1,8 63,8.1 63,8.6 IC1.22
  Bottom 0.2: v66.3,35.9 52,35.9 51.9,36 51.9,36.4 LED120.A
N$10  (via drill 0.3)
  Top 0.2: LED9.A 58.7,85.4 58.7,79.6 LED25.A 58.7,78.4 58.7,72.6 LED41.A 58.7,71.4 58.7,65.6 LED57.A 58.7,64.4 58.7,58.6 LED73.A 58.7,57.4 58.7,51.6 LED89.A 58.7,50.4 58.7,44.6 LED105.A 58.7,43.4 58.7,37.6 LED121.A 59.3,36.8 59.3,35.9 65.2,35.9 65.3,35.8 65.3,28.1 65.2,28 65.1,28 65,27.9 65,27.8 64.9,27.7 v64.9,17.8 | v59.1,17.8 59,17.8 58.9,17.7 58.9,12.7 59.1,12.7 59.2,12.6 59.2,9.9 IC1.16
  Bottom 0.2: v59.1,17.8 59.1,17.6 64.8,17.6 64.9,17.7 v64.9,17.8
N$11  (via drill 0.3)
  Top 0.2: LED10.A 65.7,85.4 65.7,79.6 LED26.A 65.7,78.4 65.7,72.6 LED42.A 65.7,71.4 65.7,65.6 LED58.A 65.7,64.4 65.7,58.6 LED74.A 65.7,57.4 65.7,51.6 LED90.A 65.7,50.4 65.7,44.6 LED106.A 65.7,43.4 65.7,37.6 LED122.A 65.7,36.4 65.7,27.7 65.4,27.7 65.3,27.6 65.3,18.2 65.5,18 v65.5,10.7 | v58.5,10.7 58.5,9.9 IC1.15
  Bottom 0.2: v58.5,10.7 58.5,10.9 65.4,10.9 65.5,10.8 v65.5,10.7
N$12  (via drill 0.3)
  Top 0.2: LED11.A 72.7,85.4 72.7,79.6 LED27.A 72.7,78.4 72.7,72.6 LED43.A 72.7,71.4 72.7,65.6 LED59.A 72.7,64.4 72.7,58.6 LED75.A 72.7,57.4 72.7,51.6 LED91.A 72.7,50.4 72.7,44.6 LED107.A 72.7,43.4 72.7,37.6 LED123.A 72.7,36.4 v72.7,16.6 | v57.9,16.6 58,16.6 58.1,16.5 58.1,15.6 58,15.6 57.9,15.5 57.9,9.9 IC1.14
  Bottom 0.2: v57.9,16.6 57.9,16.8 72.6,16.8 72.7,16.7 v72.7,16.6
N$13  (via drill 0.3)
  Top 0.2: LED12.A 79.7,85.4 79.7,79.6 LED28.A 79.7,78.4 79.7,72.6 LED44.A 79.7,71.4 79.7,65.6 LED60.A 79.7,64.4 79.7,58.6 LED76.A 79.7,57.4 79.7,51.6 LED92.A 79.7,50.4 79.7,44.6 LED108.A 79.7,43.4 79.7,37.6 LED124.A 79.7,36.4 v79.7,15.7 | v57.5,15.9 57.5,11.4 57.4,11.4 57.3,11.3 57.3,9.9 IC1.13
  Bottom 0.2: v57.5,15.9 62.9,15.9 63,15.8 63.1,15.8 63.2,15.7 63.2,15.6 63.3,15.5 79.6,15.5 79.7,15.6 v79.7,15.7
N$14  (via drill 0.3)
  Top 0.2: LED13.A 86.7,85.4 86.7,79.6 LED29.A 86.7,78.4 86.7,72.6 LED45.A 86.7,71.4 86.7,65.6 LED61.A 86.7,64.4 86.7,58.6 LED77.A 86.7,57.4 86.7,51.6 LED93.A 86.7,50.4 86.7,44.6 LED109.A 86.7,43.4 86.7,37.6 LED125.A 86.7,36.4 86.7,10.7 v86.9,10.7 | v56.6,10.5 56.6,9.9 IC1.12
  Bottom 0.2: v56.6,10.5 56.6,10.1 65.7,10.1 66.1,10.5 66.1,10.9 86.8,10.9 86.9,10.8 v86.9,10.7
N$15  (via drill 0.3)
  Top 0.2: LED14.A 93.7,85.4 93.7,79.6 LED30.A 93.7,78.4 93.7,72.6 LED46.A 93.7,71.4 93.7,65.6 LED62.A 93.7,64.4 93.7,58.6 LED78.A 93.7,57.4 93.7,51.6 LED94.A 93.7,50.4 93.7,44.6 LED110.A 93.7,43.4 93.7,37.6 LED126.A 93.7,36.4 v93.7,15.3 | v56,15.5 56,9.9 IC1.11
  Bottom 0.2: v56,15.5 57.1,15.5 57.2,15.4 57.2,15.1 61.7,15.1 61.8,15.2 61.8,15.5 62.8,15.5 62.9,15.4 62.9,15.1 93.6,15.1 93.7,15.2 v93.7,15.3
N$16  (via drill 0.3)
  Top 0.2: LED15.A 100.7,85.4 100.7,79.6 LED31.A 100.7,78.4 100.7,72.6 LED47.A 100.7,71.4 100.7,65.6 LED63.A 100.7,64.4 100.7,58.6 LED79.A 100.7,57.4 100.7,51.6 LED95.A 100.7,50.4 100.7,44.6 LED111.A 100.7,43.4 100.7,37.6 LED127.A 100.7,36.4 v100.7,19.1 | v55.4,17.8 55.4,15.2 55.5,15.2 55.6,15.1 55.6,11.4 55.5,11.4 55.4,11.3 55.4,9.9 IC1.10
  Bottom 0.2: v55.4,17.8 55.4,18 55.6,18 55.7,18.1 55.8,18.1 55.9,18.2 55.9,18.3 56,18.4 56,19.3 100.6,19.3 100.7,19.2 v100.7,19.1
N$17  (via drill 0.3)
  Top 0.2: LED16.A 107.7,85.4 107.7,79.6 LED32.A 107.7,78.4 107.7,72.6 LED48.A 107.7,71.4 107.7,65.6 LED64.A 107.7,64.4 107.7,58.6 LED80.A 107.7,57.4 107.7,51.6 LED96.A 107.7,50.4 107.7,44.6 LED112.A 107.7,43.4 107.7,37.6 LED128.A 107.7,36.4 107.7,35 106,35 105.9,34.9 105.9,21.4 106,21.4 106.1,21.3 106.1,10.7 v105.4,10.7 | v54.7,8 54.7,8.6 IC1.9
  Bottom 0.2: v54.7,8 54.7,9.7 65.8,9.7 65.9,9.8 66,9.8 66.1,9.9 66.1,10 66.2,10.1 66.3,10.1 66.4,10.2 66.4,10.3 66.5,10.4 66.6,10.4 66.7,10.5 86.3,10.5 86.4,10.4 86.4,10.1 87.4,10.1 87.5,10.2 87.5,10.9 105.3,10.9 105.4,10.8 v105.4,10.7
N$18
  Top 0.2: IC1.3 50.9,8.6 50.9,7.7 50.8,7.6 48.6,7.6 48.6,10.4 48.7,10.5 48.7,10.6 48.8,10.7 48.8,16.5 48.7,16.6 48.2,16.6 48.2,20.3 48.9,21 49.1,21 49.1,21.3 49.3,21.5 49.3,27.2 49.7,27.6 49.7,34.9 49,35.6 49,51.1 48.9,51.2 48.9,51.3 48.8,51.4 48.8,57.6 48.6,57.8 48.6,64.5 48.5,64.6 48.4,64.6 48.4,71.6 48.3,71.7 48.2,71.7 48.2,72.4 48.1,72.5 48.1,76.9 48,77 47.3,77 47.3,78.4 LED23.K
  Bottom 0.2: LED32.K 110.1,79.6 110,79.7 108.6,79.7 108.5,79.8 108.2,79.8 108.1,79.9 107.3,79.9 107.2,79.8 106.7,79.8 106.6,79.7 103.6,79.7 103.5,79.6 LED31.K 103.1,79.6 103,79.7 101.8,79.7 101.7,79.8 101.2,79.8 101.1,79.9 100.3,79.9 100.2,79.8 99.9,79.8 99.8,79.7 96.6,79.7 96.5,79.6 LED30.K 96.1,79.6 96,79.7 94.8,79.7 94.7,79.8 94.2,79.8 94.1,79.9 93.3,79.9 93.2,79.8 92.9,79.8 92.8,79.7 89.6,79.7 89.5,79.6 LED29.K 89.1,79.6 89,79.7 87.8,79.7 87.7,79.8 87.2,79.8 87.1,79.9 86.3,79.9 86.2,79.8 85.9,79.8 85.8,79.7 82.6,79.7 82.5,79.6 LED28.K 82.1,79.6 82,79.7 80.8,79.7 80.7,79.8 80.2,79.8 80.1,79.9 79.3,79.9 79.2,79.8 78.9,79.8 78.8,79.7 75.6,79.7 75.5,79.6 LED27.K 75.1,79.6 75,79.7 73.8,79.7 73.7,79.8 73.2,79.8 73.1,79.9 72.3,79.9 72.2,79.8 71.9,79.8 71.8,79.7 68.6,79.7 68.5,79.6 LED26.K 68.1,79.6 68,79.7 66.8,79.7 66.7,79.8 66.2,79.8 66.1,79.9 65.3,79.9 65.2,79.8 64.9,79.8 64.8,79.7 61.6,79.7 61.5,79.6 LED25.K 61.1,79.6 61,79.7 59.8,79.7 59.7,79.8 59.2,79.8 59.1,79.9 58.3,79.9 58.2,79.8 57.9,79.8 57.8,79.7 54.6,79.7 54.5,79.6 LED24.K 54.1,79.6 54,79.7 52.6,79.7 52.5,79.8 52.2,79.8 52.1,79.9 51.3,79.9 51.2,79.8 50.7,79.8 50.6,79.7 47.6,79.7 47.5,79.6 LED23.K 47.1,79.6 47,79.7 45.8,79.7 45.7,79.8 45.2,79.8 45.1,79.9 44.3,79.9 44.2,79.8 43.9,79.8 43.8,79.7 40.6,79.7 40.5,79.6 LED22.K 40.1,79.6 40,79.7 38.8,79.7 38.7,79.8 38.2,79.8 38.1,79.9 37.3,79.9 37.2,79.8 36.9,79.8 36.8,79.7 33.6,79.7 33.5,79.6 LED21.K 33.1,79.6 33,79.7 31.8,79.7 31.7,79.8 31.2,79.8 31.1,79.9 30.3,79.9 30.2,79.8 29.9,79.8 29.8,79.7 26.6,79.7 26.5,79.6 LED20.K 26.1,79.6 26,79.7 24.8,79.7 24.7,79.8 24.2,79.8 24.1,79.9 23.3,79.9 23.2,79.8 22.9,79.8 22.8,79.7 19.6,79.7 19.5,79.6 LED19.K 19.1,79.6 19,79.7 17.8,79.7 17.7,79.8 17.2,79.8 17.1,79.9 16.3,79.9 16.2,79.8 15.9,79.8 15.8,79.7 12.6,79.7 12.5,79.6 LED18.K 12.1,79.6 12,79.7 10.8,79.7 10.7,79.8 10.2,79.8 10.1,79.9 9.3,79.9 9.2,79.8 8.9,79.8 8.8,79.7 5.6,79.7 5.5,79.6 LED17.K
N$19  (via drill 0.3)
  Top 0.2: v48.8,72 48.8,64.8 49,64.6 49,57.9 49.2,57.7 49.2,51.5 49.3,51.4 49.3,51.3 49.4,51.2 49.4,35.7 50.1,35 50.1,27.5 49.7,27.1 49.7,21.4 49.5,21.2 49.5,20.6 49,20.6 48.6,20.2 48.6,17 49.1,17 49.2,16.9 49.2,10.4 49.1,10.4 49,10.3 49,8 50.2,8 50.3,8.1 50.3,8.6 IC1.2
  Bottom 0.2: LED48.K 110.1,72.6 110,72.7 108.8,72.7 108.7,72.8 108.2,72.8 108.1,72.9 107.3,72.9 107.2,72.8 106.9,72.8 106.8,72.7 103.6,72.7 103.5,72.6 LED47.K 103.1,72.6 103,72.7 101.8,72.7 101.7,72.8 101.2,72.8 101.1,72.9 100.3,72.9 100.2,72.8 99.9,72.8 99.8,72.7 96.6,72.7 96.5,72.6 LED46.K 96.1,72.6 96,72.7 94.8,72.7 94.7,72.8 94.2,72.8 94.1,72.9 93.3,72.9 93.2,72.8 92.9,72.8 92.8,72.7 89.6,72.7 89.5,72.6 LED45.K 89.1,72.6 89,72.7 87.8,72.7 87.7,72.8 87.2,72.8 87.1,72.9 86.3,72.9 86.2,72.8 85.9,72.8 85.8,72.7 82.6,72.7 82.5,72.6 LED44.K 82.1,72.6 82,72.7 80.8,72.7 80.7,72.8 80.2,72.8 80.1,72.9 79.3,72.9 79.2,72.8 78.9,72.8 78.8,72.7 75.6,72.7 75.5,72.6 LED43.K 75.1,72.6 75,72.7 73.8,72.7 73.7,72.8 73.2,72.8 73.1,72.9 72.3,72.9 72.2,72.8 71.9,72.8 71.8,72.7 68.6,72.7 68.5,72.6 LED42.K 68.1,72.6 68,72.7 66.8,72.7 66.7,72.8 66.2,72.8 66.1,72.9 65.3,72.9 65.2,72.8 64.9,72.8 64.8,72.7 61.6,72.7 61.5,72.6 LED41.K 61.1,72.6 61,72.7 59.6,72.7 59.5,72.8 59.2,72.8 59.1,72.9 58.3,72.9 58.2,72.8 57.7,72.8 57.6,72.7 54.6,72.7 54.5,72.6 LED40.K 54.1,72.6 54,72.7 52.6,72.7 52.5,72.8 52.2,72.8 52.1,72.9 51.3,72.9 51.2,72.8 50.7,72.8 50.6,72.7 50.6,72.3 48.9,72.3 v48.8,72 LED39.K 47.1,72.6 47,72.7 45.8,72.7 45.7,72.8 45.2,72.8 45.1,72.9 44.3,72.9 44.2,72.8 43.9,72.8 43.8,72.7 40.6,72.7 40.5,72.6 LED38.K 40.1,72.6 40,72.7 38.8,72.7 38.7,72.8 38.2,72.8 38.1,72.9 37.3,72.9 37.2,72.8 36.9,72.8 36.8,72.7 33.6,72.7 33.5,72.6 LED37.K 33.1,72.6 33,72.7 31.8,72.7 31.7,72.8 31.2,72.8 31.1,72.9 30.3,72.9 30.2,72.8 29.9,72.8 29.8,72.7 26.6,72.7 26.5,72.6 LED36.K 26.1,72.6 26,72.7 24.8,72.7 24.7,72.8 24.2,72.8 24.1,72.9 23.3,72.9 23.2,72.8 22.9,72.8 22.8,72.7 19.6,72.7 19.5,72.6 LED35.K 19.1,72.6 19,72.7 17.8,72.7 17.7,72.8 17.2,72.8 17.1,72.9 16.3,72.9 16.2,72.8 15.9,72.8 15.8,72.7 12.6,72.7 12.5,72.6 LED34.K 12.1,72.6 12,72.7 10.8,72.7 10.7,72.8 10.2,72.8 10.1,72.9 9.3,72.9 9.2,72.8 8.9,72.8 8.8,72.7 5.6,72.7 5.5,72.6 LED33.K
N$20  (via drill 0.3)
  Top 0.2: v49.4,65 49.4,58 49.6,57.8 49.6,51.6 49.7,51.5 49.7,51.4 49.8,51.3 49.8,35.8 50.5,35.1 50.5,27.4 50.1,27 50.1,21.3 49.9,21.1 49.9,20.2 49.1,20.2 49,20.1 49,17.6 49.4,17.2 49.5,17.2 49.5,17.1 49.6,17 49.6,9.9 IC1.1
  Bottom 0.2: LED64.K 110.1,65.6 110,65.7 108.8,65.7 108.7,65.8 108.2,65.8 108.1,65.9 107.3,65.9 107.2,65.8 106.9,65.8 106.8,65.7 103.6,65.7 103.5,65.6 LED63.K 103.1,65.6 103,65.7 101.8,65.7 101.7,65.8 101.2,65.8 101.1,65.9 100.3,65.9 100.2,65.8 99.9,65.8 99.8,65.7 96.6,65.7 96.5,65.6 LED62.K 96.1,65.6 96,65.7 94.8,65.7 94.7,65.8 94.2,65.8 94.1,65.9 93.3,65.9 93.2,65.8 92.9,65.8 92.8,65.7 89.6,65.7 89.5,65.6 LED61.K 89.1,65.6 89,65.7 87.8,65.7 87.7,65.8 87.2,65.8 87.1,65.9 86.3,65.9 86.2,65.8 85.9,65.8 85.8,65.7 82.6,65.7 82.5,65.6 LED60.K 82.1,65.6 82,65.7 80.8,65.7 80.7,65.8 80.2,65.8 80.1,65.9 79.3,65.9 79.2,65.8 78.9,65.8 78.8,65.7 75.6,65.7 75.5,65.6 LED59.K 75.1,65.6 75,65.7 73.8,65.7 73.7,65.8 73.2,65.8 73.1,65.9 72.3,65.9 72.2,65.8 71.9,65.8 71.8,65.7 68.6,65.7 68.5,65.6 LED58.K 68.1,65.6 68,65.7 66.8,65.7 66.7,65.8 66.2,65.8 66.1,65.9 65.3,65.9 65.2,65.8 64.9,65.8 64.8,65.7 61.6,65.7 61.5,65.6 LED57.K 61.1,65.6 61,65.7 59.6,65.7 59.5,65.8 59.2,65.8 59.1,65.9 58.3,65.9 58.2,65.8 57.7,65.8 57.6,65.7 54.6,65.7 54.5,65.6 LED56.K 54.1,65.6 54,65.7 52.6,65.7 52.5,65.8 52.2,65.8 52.1,65.9 51.3,65.9 51.2,65.8 50.7,65.8 50.6,65.7 50.6,65.3 49.5,65.3 v49.4,65 LED55.K 47.1,65.6 47,65.7 45.8,65.7 45.7,65.8 45.2,65.8 45.1,65.9 44.3,65.9 44.2,65.8 43.9,65.8 43.8,65.7 40.6,65.7 40.5,65.6 LED54.K 40.1,65.6 40,65.7 38.8,65.7 38.7,65.8 38.2,65.8 38.1,65.9 37.3,65.9 37.2,65.8 36.9,65.8 36.8,65.7 33.6,65.7 33.5,65.6 LED53.K 33.1,65.6 33,65.7 31.8,65.7 31.7,65.8 31.2,65.8 31.1,65.9 30.3,65.9 30.2,65.8 29.9,65.8 29.8,65.7 26.6,65.7 26.5,65.6 LED52.K 26.1,65.6 26,65.7 24.8,65.7 24.7,65.8 24.2,65.8 24.1,65.9 23.3,65.9 23.2,65.8 22.9,65.8 22.8,65.7 19.6,65.7 19.5,65.6 LED51.K 19.1,65.6 19,65.7 17.8,65.7 17.7,65.8 17.2,65.8 17.1,65.9 16.3,65.9 16.2,65.8 15.9,65.8 15.8,65.7 12.6,65.7 12.5,65.6 LED50.K 12.1,65.6 12,65.7 10.8,65.7 10.7,65.8 10.2,65.8 10.1,65.9 9.3,65.9 9.2,65.8 8.9,65.8 8.8,65.7 5.6,65.7 5.5,65.6 LED49.K
N$21  (via drill 0.3)
  Top 0.2: v50,58.2 50,51.7 50.1,51.6 50.1,51.5 50.2,51.4 50.2,35.9 50.6,35.5 50.8,35.5 50.9,35.4 50.9,27.3 50.5,26.9 50.5,21.1 50.4,21.1 50.3,21 50.3,19.6 IC1.47
  Bottom 0.2: LED80.K 110.1,58.6 110,58.7 108.8,58.7 108.7,58.8 108.2,58.8 108.1,58.9 107.3,58.9 107.2,58.8 106.9,58.8 106.8,58.7 103.6,58.7 103.5,58.6 LED79.K 103.1,58.6 103,58.7 101.8,58.7 101.7,58.8 101.2,58.8 101.1,58.9 100.3,58.9 100.2,58.8 99.9,58.8 99.8,58.7 96.6,58.7 96.5,58.6 LED78.K 96.1,58.6 96,58.7 94.8,58.7 94.7,58.8 94.2,58.8 94.1,58.9 93.3,58.9 93.2,58.8 92.9,58.8 92.8,58.7 89.6,58.7 89.5,58.6 LED77.K 89.1,58.6 89,58.7 87.8,58.7 87.7,58.8 87.2,58.8 87.1,58.9 86.3,58.9 86.2,58.8 85.9,58.8 85.8,58.7 82.6,58.7 82.5,58.6 LED76.K 82.1,58.6 82,58.7 80.8,58.7 80.7,58.8 80.2,58.8 80.1,58.9 79.3,58.9 79.2,58.8 78.9,58.8 78.8,58.7 75.6,58.7 75.5,58.6 LED75.K 75.1,58.6 75,58.7 73.8,58.7 73.7,58.8 73.2,58.8 73.1,58.9 72.3,58.9 72.2,58.8 71.9,58.8 71.8,58.7 68.6,58.7 68.5,58.6 LED74.K 68.1,58.6 68,58.7 66.8,58.7 66.7,58.8 66.2,58.8 66.1,58.9 65.3,58.9 65.2,58.8 64.9,58.8 64.8,58.7 61.6,58.7 61.5,58.6 LED73.K 61.1,58.6 61,58.7 59.6,58.7 59.5,58.8 59.2,58.8 59.1,58.9 58.3,58.9 58.2,58.8 57.7,58.8 57.6,58.7 54.6,58.7 54.5,58.6 LED72.K 54.1,58.6 54,58.7 52.6,58.7 52.5,58.8 52.2,58.8 52.1,58.9 51.3,58.9 51.2,58.8 50.7,58.8 50.6,58.7 50.6,58.5 50.1,58.5 v50,58.2 49.9,58.1 49.3,58.1 49.2,58 LED71.K 47.1,58.6 47,58.7 45.8,58.7 45.7,58.8 45.2,58.8 45.1,58.9 44.3,58.9 44.2,58.8 43.9,58.8 43.8,58.7 40.6,58.7 40.5,58.6 LED70.K 40.1,58.6 40,58.7 38.8,58.7 38.7,58.8 38.2,58.8 38.1,58.9 37.3,58.9 37.2,58.8 36.9,58.8 36.8,58.7 33.6,58.7 33.5,58.6 LED69.K 33.1,58.6 33,58.7 31.8,58.7 31.7,58.8 31.2,58.8 31.1,58.9 30.3,58.9 30.2,58.8 29.9,58.8 29.8,58.7 26.6,58.7 26.5,58.6 LED68.K 26.1,58.6 26,58.7 24.8,58.7 24.7,58.8 24.2,58.8 24.1,58.9 23.3,58.9 23.2,58.8 22.9,58.8 22.8,58.7 19.6,58.7 19.5,58.6 LED67.K 19.1,58.6 19,58.7 17.8,58.7 17.7,58.8 17.2,58.8 17.1,58.9 16.3,58.9 16.2,58.8 15.9,58.8 15.8,58.7 12.6,58.7 12.5,58.6 LED66.K 12.1,58.6 12,58.7 10.8,58.7 10.7,58.8 10.2,58.8 10.1,58.9 9.3,58.9 9.2,58.8 8.9,58.8 8.8,58.7 5.6,58.7 5.5,58.6 LED65.K
N$22  (via drill 0.3)
  Top 0.2: v50.8,50.4 50.7,50.4 50.6,50.3 50.6,36 50.7,35.9 51.2,35.9 51.3,35.8 51.3,27.2 51.1,27 51.1,26.9 51,26.9 50.9,26.8 50.9,19.6 IC1.46
  Bottom 0.2: LED96.K 110.1,51.6 110,51.7 108.8,51.7 108.7,51.8 108.2,51.8 108.1,51.9 107.3,51.9 107.2,51.8 106.9,51.8 106.8,51.7 103.6,51.7 103.5,51.6 LED95.K 103.1,51.6 103,51.7 101.8,51.7 101.7,51.8 101.2,51.8 101.1,51.9 100.3,51.9 100.2,51.8 99.9,51.8 99.8,51.7 96.6,51.7 96.5,51.6 LED94.K 96.1,51.6 96,51.7 94.8,51.7 94.7,51.8 94.2,51.8 94.1,51.9 93.3,51.9 93.2,51.8 92.9,51.8 92.8,51.7 89.6,51.7 89.5,51.6 LED93.K 89.1,51.6 89,51.7 87.8,51.7 87.7,51.8 87.2,51.8 87.1,51.9 86.3,51.9 86.2,51.8 85.9,51.8 85.8,51.7 82.6,51.7 82.5,51.6 LED92.K 82.1,51.6 82,51.7 80.8,51.7 80.7,51.8 80.2,51.8 80.1,51.9 79.3,51.9 79.2,51.8 78.9,51.8 78.8,51.7 75.6,51.7 75.5,51.6 LED91.K 75.1,51.6 75,51.7 73.8,51.7 73.7,51.8 73.2,51.8 73.1,51.9 72.3,51.9 72.2,51.8 71.9,51.8 71.8,51.7 68.6,51.7 68.5,51.6 LED90.K 68.1,51.6 68,51.7 66.8,51.7 66.7,51.8 66.2,51.8 66.1,51.9 65.3,51.9 65.2,51.8 64.9,51.8 64.8,51.7 61.6,51.7 61.5,51.6 LED89.K 61.1,51.6 61,51.7 59.6,51.7 59.5,51.8 59.2,51.8 59.1,51.9 58.3,51.9 58.2,51.8 57.7,51.8 57.6,51.7 54.6,51.7 54.5,51.6 LED88.K 54.1,50.4 54,50.3 52.6,50.3 52.5,50.2 52.2,50.2 52.1,50.1 51.3,50.1 51.2,50.2 51,50.2 v50.8,50.4 47.5,50.4 LED87.K 47.1,51.6 47,51.7 45.8,51.7 45.7,51.8 45.2,51.8 45.1,51.9 44.3,51.9 44.2,51.8 43.9,51.8 43.8,51.7 40.6,51.7 40.5,51.6 LED86.K 40.1,51.6 40,51.7 38.8,51.7 38.7,51.8 38.2,51.8 38.1,51.9 37.3,51.9 37.2,51.8 36.9,51.8 36.8,51.7 33.6,51.7 33.5,51.6 LED85.K 33.1,51.6 33,51.7 31.8,51.7 31.7,51.8 31.2,51.8 31.1,51.9 30.3,51.9 30.2,51.8 29.9,51.8 29.8,51.7 26.6,51.7 26.5,51.6 LED84.K 26.1,51.6 26,51.7 24.8,51.7 24.7,51.8 24.2,51.8 24.1,51.9 23.3,51.9 23.2,51.8 22.9,51.8 22.8,51.7 19.6,51.7 19.5,51.6 LED83.K 19.1,51.6 19,51.7 17.8,51.7 17.7,51.8 17.2,51.8 17.1,51.9 16.3,51.9 16.2,51.8 15.9,51.8 15.8,51.7 12.6,51.7 12.5,51.6 LED82.K 12.1,51.6 12,51.7 10.8,51.7 10.7,51.8 10.2,51.8 10.1,51.9 9.3,51.9 9.2,51.8 8.9,51.8 8.8,51.7 5.6,51.7 5.5,51.6 LED81.K
N$23  (via drill 0.3)
  Top 0.2: v51.5,20.7 51.5,19.6 IC1.45 | v52.8,20.7 52.6,20.7 52.6,26.4 52.7,26.5 52.7,27.2 52.6,27.3 52.6,27.4 52.5,27.5 52.5,35.4 52.6,35.5 53.2,35.5 53.2,36.6 53.3,36.7 53.4,36.7 53.4,37.4 53.5,37.5 53.5,43.7 53.6,43.8 53.7,43.8 LED104.K
  Bottom 0.2: LED112.K 110.1,44.6 110,44.7 108.8,44.7 108.7,44.8 108.2,44.8 108.1,44.9 107.3,44.9 107.2,44.8 106.9,44.8 106.8,44.7 103.6,44.7 103.5,44.6 LED111.K 103.1,44.6 103,44.7 101.8,44.7 101.7,44.8 101.2,44.8 101.1,44.9 100.3,44.9 100.2,44.8 99.9,44.8 99.8,44.7 96.6,44.7 96.5,44.6 LED110.K 96.1,44.6 96,44.7 94.8,44.7 94.7,44.8 94.2,44.8 94.1,44.9 93.3,44.9 93.2,44.8 92.9,44.8 92.8,44.7 89.6,44.7 89.5,44.6 LED109.K 89.1,44.6 89,44.7 87.8,44.7 87.7,44.8 87.2,44.8 87.1,44.9 86.3,44.9 86.2,44.8 85.9,44.8 85.8,44.7 82.6,44.7 82.5,44.6 LED108.K 82.1,44.6 82,44.7 80.8,44.7 80.7,44.8 80.2,44.8 80.1,44.9 79.3,44.9 79.2,44.8 78.9,44.8 78.8,44.7 75.6,44.7 75.5,44.6 LED107.K 75.1,44.6 75,44.7 73.8,44.7 73.7,44.8 73.2,44.8 73.1,44.9 72.3,44.9 72.2,44.8 71.9,44.8 71.8,44.7 68.6,44.7 68.5,44.6 LED106.K 68.1,44.6 68,44.7 66.8,44.7 66.7,44.8 66.2,44.8 66.1,44.9 65.3,44.9 65.2,44.8 64.9,44.8 64.8,44.7 61.6,44.7 61.5,44.6 LED105.K 61.1,44.6 61,44.7 59.6,44.7 59.5,44.8 59.2,44.8 59.1,44.9 58.3,44.9 58.2,44.8 57.7,44.8 57.6,44.7 54.6,44.7 54.5,44.6 LED104.K 54.1,44.6 54,44.7 52.8,44.7 52.7,44.8 52.2,44.8 52.1,44.9 51.3,44.9 51.2,44.8 50.9,44.8 50.8,44.7 47.6,44.7 47.5,44.6 LED103.K 47.1,44.6 47,44.7 45.8,44.7 45.7,44.8 45.2,44.8 45.1,44.9 44.3,44.9 44.2,44.8 43.9,44.8 43.8,44.7 40.6,44.7 40.5,44.6 LED102.K 40.1,44.6 40,44.7 38.8,44.7 38.7,44.8 38.2,44.8 38.1,44.9 37.3,44.9 37.2,44.8 36.9,44.8 36.8,44.7 33.6,44.7 33.5,44.6 LED101.K 33.1,44.6 33,44.7 31.8,44.7 31.7,44.8 31.2,44.8 31.1,44.9 30.3,44.9 30.2,44.8 29.9,44.8 29.8,44.7 26.6,44.7 26.5,44.6 LED100.K 26.1,44.6 26,44.7 24.8,44.7 24.7,44.8 24.2,44.8 24.1,44.9 23.3,44.9 23.2,44.8 22.9,44.8 22.8,44.7 19.6,44.7 19.5,44.6 LED99.K 19.1,44.6 19,44.7 17.8,44.7 17.7,44.8 17.2,44.8 17.1,44.9 16.3,44.9 16.2,44.8 15.9,44.8 15.8,44.7 12.6,44.7 12.5,44.6 LED98.K 12.1,44.6 12,44.7 10.8,44.7 10.7,44.8 10.2,44.8 10.1,44.9 9.3,44.9 9.2,44.8 8.9,44.8 8.8,44.7 5.6,44.7 5.5,44.6 LED97.K
  Bottom 0.2: v52.8,20.7 v51.5,20.7
N$24  (via drill 0.3)
  Top 0.2: v52.8,37 52.8,35.9 52.2,35.9 52.1,35.8 52.1,27.2 52.2,27.2 52.3,27.1 52.3,26.6 52.2,26.5 52.2,19.6 IC1.44
  Bottom 0.2: LED128.K 110.1,37.6 110,37.7 108.8,37.7 108.7,37.8 108.2,37.8 108.1,37.9 107.3,37.9 107.2,37.8 106.9,37.8 106.9,37.5 106.8,37.4 105.8,37.4 105.8,37.1 105.7,37 LED127.K 103.1,37.6 103,37.7 101.8,37.7 101.7,37.8 101.2,37.8 101.1,37.9 100.3,37.9 100.2,37.8 99.9,37.8 99.8,37.7 96.6,37.7 96.5,37.6 LED126.K 96.1,37.6 96,37.7 94.8,37.7 94.7,37.8 94.2,37.8 94.1,37.9 93.3,37.9 93.2,37.8 92.9,37.8 92.9,37.5 92.8,37.4 91.8,37.4 91.8,37.1 91.7,37 LED125.K 89.1,37.6 89,37.7 87.8,37.7 87.7,37.8 87.2,37.8 87.1,37.9 86.3,37.9 86.2,37.8 85.9,37.8 85.8,37.7 82.6,37.7 82.5,37.6 LED124.K 82.1,37.6 82,37.7 80.8,37.7 80.7,37.8 80.2,37.8 80.1,37.9 79.3,37.9 79.2,37.8 78.9,37.8 78.9,37.5 78.8,37.4 77.8,37.4 77.8,37.1 77.7,37 LED123.K 75.1,37.6 75,37.7 73.8,37.7 73.7,37.8 73.2,37.8 73.1,37.9 72.3,37.9 72.2,37.8 71.9,37.8 71.8,37.7 68.6,37.7 68.5,37.6 LED122.K 68.1,37.6 68,37.7 66.8,37.7 66.7,37.8 66.2,37.8 66.1,37.9 65.3,37.9 65.2,37.8 64.9,37.8 64.8,37.7 61.6,37.7 61.5,37.6 LED121.K 61.1,37.6 61,37.7 59.6,37.7 59.5,37.8 59.2,37.8 59.1,37.9 58.3,37.9 58.2,37.8 57.7,37.8 57.6,37.7 54.6,37.7 54.5,37.6 LED120.K v52.8,37 52.8,37.7 52.7,37.8 52.2,37.8 52.1,37.9 51.3,37.9 51.2,37.8 50.9,37.8 50.8,37.7 47.6,37.7 47.5,37.6 LED119.K 47.1,37.6 47,37.7 45.8,37.7 45.7,37.8 45.2,37.8 45.1,37.9 44.3,37.9 44.2,37.8 43.9,37.8 43.8,37.7 40.6,37.7 40.5,37.6 LED118.K 40.1,37.6 40,37.7 38.8,37.7 38.7,37.8 38.2,37.8 38.1,37.9 37.3,37.9 37.2,37.8 36.9,37.8 36.8,37.7 33.6,37.7 33.5,37.6 LED117.K 33.1,37.6 33,37.7 31.8,37.7 31.7,37.8 31.2,37.8 31.1,37.9 30.3,37.9 30.2,37.8 29.9,37.8 29.8,37.7 26.6,37.7 26.5,37.6 LED116.K 26.1,37.6 26,37.7 24.8,37.7 24.7,37.8 24.2,37.8 24.1,37.9 23.3,37.9 23.2,37.8 22.9,37.8 22.8,37.7 19.6,37.7 19.5,37.6 LED115.K 19.1,37.6 19,37.7 17.8,37.7 17.7,37.8 17.2,37.8 17.1,37.9 16.3,37.9 16.2,37.8 15.9,37.8 15.8,37.7 12.6,37.7 12.5,37.6 LED114.K 12.1,37.6 12,37.7 10.8,37.7 10.7,37.8 10.2,37.8 10.1,37.9 9.3,37.9 9.2,37.8 8.9,37.8 8.8,37.7 5.6,37.7 5.5,37.6 LED113.K
N$25  (via drill 0.3)
  Top 0.2: v53.3,28 53.4,28 53.5,27.9 53.5,22.2 53.2,22.2 53.1,22.1 53.1,21.2 53.3,21.2 53.4,21.1 53.4,19.6 IC1.42
  Bottom 0.2: v53.3,28 53.3,27.8 5.6,27.8 5.5,27.9 5.5,29.2 4.5,29.2 SV1.16
N$26  (via drill 0.3)
  Top 0.2: v54.9,27.6 54.8,27.6 54.7,27.5 54.7,21.6 54.8,21.6 54.9,21.5 54.9,20.4 54.2,20.4 54.1,20.3 54.1,19.6 IC1.41
  Bottom 0.2: SV1.14 4.9,27.4 54.9,27.4 v54.9,27.6 55.1,27.4 107.1,27.4 SV2.14
N$27  (via drill 0.3)
  Top 0.2: v55.3,26.4 55.2,26.4 55.1,26.3 55.1,21.8 55.2,21.8 55.3,21.7 55.3,20.3 55.2,20.2 55.2,20.1 55.1,20 54.7,20 54.7,19.6 IC1.40
  Bottom 0.2: v55.3,26.4 55.3,26.6 65.3,26.6 65.4,26.5 65.4,26.2 | 65.4,26.2 66.4,26.2 66.5,26.3 66.5,27 106.4,27 106.5,26.9 106.5,25.5 107.5,25.5 SV2.12 | 65.4,26.2 65.4,24.9 65.3,24.8 4.9,24.8 SV1.12
N$28  (via drill 0.3)
  Top 0.2: v55.7,22.1 55.7,20.2 55.6,20.1 55.6,19.9 55.5,19.8 55.5,19.6 IC1.39
  Bottom 0.2: SV1.10 4.9,22.3 55.7,22.3 v55.7,22.1 55.9,22.3 107.1,22.3 SV2.10
N$29  (via drill 0.3)
  Top 0.2: v56.3,20.2 56.1,20.2 56.1,20.1 56,20 56,19.6 IC1.38
  Bottom 0.2: 56.3,19.7 v56.3,20.2 | 56.3,19.7 107.1,19.7 SV2.8 | 56.3,19.7 55.6,19.7 55.6,18.5 55.5,18.4 5.8,18.4 5.7,18.5 5.4,18.5 5.4,18.6 5.3,18.7 5.2,18.7 5.1,18.8 5.1,18.9 5,19 4.7,19 4.6,19.1 SV1.8
N$30  (via drill 0.3)
  Top 0.2: v57.3,17.2 57.3,18.3 IC1.36
  Bottom 0.2: SV1.6 4.9,17.2 v57.3,17.2 107.1,17.2 SV2.6
N$31  (via drill 0.3)
  Top 0.2: v57.9,20.3 57.9,19.6 IC1.35 | v108.9,20.9 108.9,15 108.8,14.9 108.4,14.9 SV2.4
  Bottom 0.2: v57.9,20.3 57.9,20.1 106.4,20.1 106.5,20.2 106.5,20.9 v108.9,20.9 | SV1.4 4.9,14.7 5.8,14.7 5.9,14.6 5.9,14.3 107.1,14.3 SV2.4
N$32  (via drill 0.3)
  Top 0.2: v58.5,12.3 58.5,18.3 IC1.34 | v61.2,12.3 61.1,12.2 61.1,9.9 IC1.19 | v41.9,12.1 41.9,12.7 C1.1
  Bottom 0.2: SV1.1 2,12.8 2,13.3 5.4,13.3 5.5,13.2 5.5,12.5 5.9,12.5 6,12.4 6.1,12.4 6.2,12.3 6.2,12.2 6.3,12.1 v41.9,12.1 46.6,12.1 46.7,12.2 46.7,12.7 58.3,12.7 58.4,12.6 v58.5,12.3 v61.2,12.3 61.4,12.1 105.6,12.1 105.6,13.2 105.7,13.3 110,13.3 110,12.8 SV2.1
N$34  (via drill 0.3)
  Top 0.2: v61.7,12.9 61.1,12.9 61,13 61,16.8 61.1,16.9 61.1,18.3 IC1.30 | v5.2,13.9 5.1,13.8 5.1,13.5 5,13.4 5,12.5 4.9,12.4 SV1.2
  Bottom 0.2: v61.7,12.9 61.7,13.1 46,13.1 45.9,13 45.9,12.7 44.2,12.7 44.1,12.8 44.1,13.9 v5.2,13.9
N$35  (via drill 0.3)
  Top 0.2: v59.8,29.2 59.8,19.6 IC1.32
  Bottom 0.2: v59.8,29.2 65.4,29.2 65.5,29.1 65.5,27.8 106.4,27.8 106.5,27.9 106.5,29.2 107.5,29.2 SV2.16
N$36  (via drill 0.3)
  Top 0.2: v59.2,21.7 59.2,19.6 IC1.33 | v106.5,21.7 106.5,12.5 106.6,12.4 107.1,12.4 SV2.2
  Bottom 0.2: v59.2,21.7 59.2,21.9 106.4,21.9 106.5,21.8 v106.5,21.7
N$37  (via drill 0.3)
  Top 0.5: SV2.11 110.3,25.5 110.3,26.7 SV2.13 110.3,28 110.3,29.2 SV2.15 | SV1.11 1.7,25.5 1.7,26.7 SV1.13 1.7,28 1.7,29.2 SV1.15 | v54.1,11.5 54.1,9.9 IC1.8 | IC1.18 60.4,9.9 v60.4,11.5 60.4,18.3 IC1.31 60.4,19.6 v60.4,24.2 | v83.9,11.5 83.9,10 C2.+
  Bottom 0.5: v54.1,11.5 v60.4,11.5 v83.9,11.5 | SV1.11 2,24.1 2,23.8 3.1,23.8 3.2,23.7 3.8,23.7 3.9,23.6 4.7,23.6 4.8,23.7 5.5,23.7 5.6,23.8 5.6,24.2 v60.4,24.2 60.5,23.9 60.5,23 60.6,22.9 106.4,22.9 106.4,23.2 106.5,23.3 107.1,23.3 107.2,23.4 107.2,23.5 107.3,23.6 108.1,23.6 108.2,23.7 108.8,23.7 108.9,23.8 110,23.8 110,24.1 SV2.11
N$38  (via drill 0.3)
  Top 0.5: SV2.5 110.3,17.9 110.3,19.1 SV2.7 110.3,20.4 110.3,21.6 SV2.9 | SV1.5 1.7,17.9 1.7,19.1 SV1.7 1.7,20.4 1.7,21.6 SV1.9 | 52.2,16.8 52.2,9.9 IC1.5 52.2,8.6 52.2,3.7 55.3,3.7 R1.2 55.9,3.7 v55.9,5.7 | 52.2,16.8 52.3,16.9 52.8,16.9 52.8,18.3 IC1.43 | 49.6,17.9 49.6,18.3 IC1.48 | 49.6,17.9 49.7,17.8 49.8,17.8 49.8,17.7 49.9,17.6 52,17.6 52,16.9 52.2,16.8 | v49.6,17.8 49.6,17.9 | v86.1,17.8 86.1,6.1 86,6 84.7,6 C2.-
  Bottom 0.5: v55.9,5.7 83.2,5.7 C2.- | v49.6,17.8 5.6,17.8 5.5,17.9 5.2,17.9 4.7,18.4 3.9,18.4 3.8,18.3 3.2,18.3 3.1,18.2 2,18.2 2,17.9 SV1.5 | v86.1,17.8 106.4,17.8 106.4,18.2 106.5,18.3 107.2,18.3 107.3,18.4 108.1,18.4 108.2,18.3 108.8,18.3 108.9,18.2 110,18.2 110,17.9 SV2.5
N$39  (via drill 0.3)
  Top 0.2: v56.6,14.9 56.6,18.3 IC1.37 | v62.3,14.9 62.3,9.9 IC1.21 | v43.1,14.9 43.1,15.3 42.6,15.3 C1.2
  Bottom 0.2: SV1.3 2,15.3 2,15.9 5.4,15.9 5.5,15.8 5.5,15.1 5.9,15.1 6,15 6.1,15 6.2,14.9 6.2,14.8 6.3,14.7 42.9,14.7 v43.1,14.9 43.1,14.7 56.4,14.7 v56.6,14.9 56.6,14.7 62.2,14.7 62.3,14.8 v62.3,14.9 62.5,14.7 105.6,14.7 105.7,14.8 105.7,14.9 105.8,15 105.9,15 106,15.1 106.5,15.1 106.5,15.8 106.6,15.9 110,15.9 110,15.3 SV2.3
N$40
  Top 0.2: IC1.17 59.8,8.6 59.8,3.8 59.7,3.7 58.2,3.7 R1.1

### Text on the board
tNames: BUZZI-41 | 16x8 LED MODULE | V.0.9 09/2007